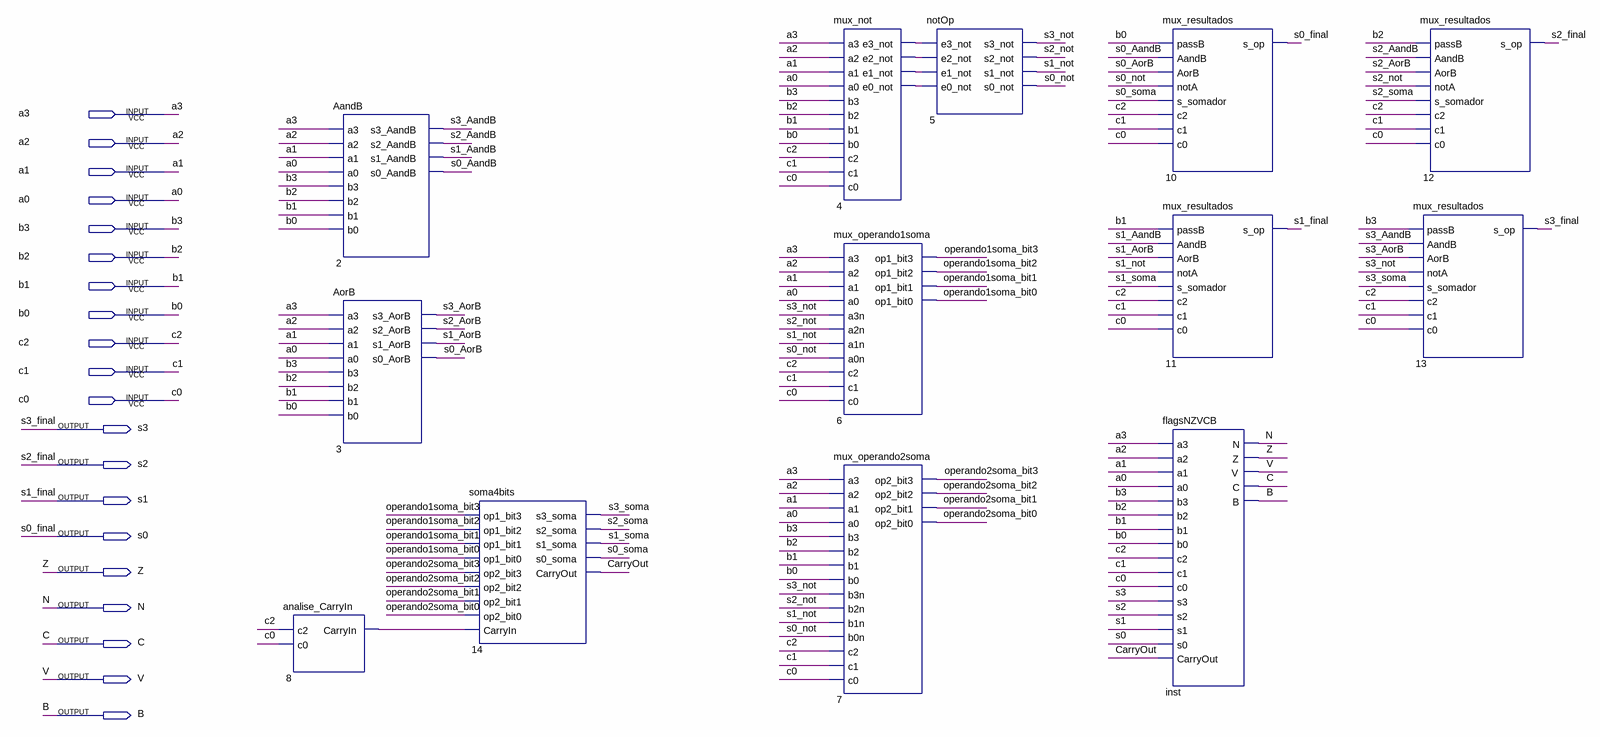
[diagram p0: schematic sheet]
// Quartus schematic ULA_main.bdf as structural Verilog: 13 symbols, 20 pins
module ULA_main (
  input  a3,
  input  a2,
  input  a1,
  input  a0,
  input  b3,
  input  b2,
  input  b1,
  input  b0,
  input  c2,
  input  c1,
  input  c0,
  output s3,
  output s2,
  output s1,
  output s0,
  output Z,
  output N,
  output C,
  output V,
  output B
);

  wire CarryOut, n4_e0_not, n4_e1_not, n4_e2_not, n4_e3_not, n8_carryin, operando1soma_bit0,
       operando1soma_bit1, operando1soma_bit2, operando1soma_bit3, operando2soma_bit0, operando2soma_bit1,
       operando2soma_bit2, operando2soma_bit3, s0_AandB, s0_AorB, s0_not, s0_soma, s1_AandB, s1_AorB, s1_not,
       s1_soma, s2_AandB, s2_AorB, s2_not, s2_soma, s3_AandB, s3_AorB, s3_not, s3_soma;

  analise_CarryIn u_8 (.c2(c2), .c0(c0), .CarryIn(n8_carryin));
  AandB u_2 (
    .a3(a3), .a2(a2), .a1(a1), .a0(a0), .b3(b3), .b2(b2), .b1(b1), .b0(b0), .s3_AandB(s3_AandB),
    .s2_AandB(s2_AandB), .s1_AandB(s1_AandB), .s0_AandB(s0_AandB));
  AorB u_3 (
    .a3(a3), .a2(a2), .a1(a1), .a0(a0), .b3(b3), .b2(b2), .b1(b1), .b0(b0), .s3_AorB(s3_AorB),
    .s2_AorB(s2_AorB), .s1_AorB(s1_AorB), .s0_AorB(s0_AorB));
  soma4bits u_14 (
    .op1_bit3(operando1soma_bit3), .op1_bit2(operando1soma_bit2), .op1_bit1(operando1soma_bit1),
    .op1_bit0(operando1soma_bit0), .op2_bit3(operando2soma_bit3), .op2_bit2(operando2soma_bit2),
    .op2_bit1(operando2soma_bit1), .op2_bit0(operando2soma_bit0), .CarryIn(n8_carryin), .s3_soma(s3_soma),
    .s2_soma(s2_soma), .s1_soma(s1_soma), .s0_soma(s0_soma), .CarryOut(CarryOut));
  mux_not u_4 (
    .a3(a3), .a2(a2), .a1(a1), .a0(a0), .b3(b3), .b2(b2), .b1(b1), .b0(b0), .c2(c2), .c1(c1), .c0(c0),
    .e3_not(n4_e3_not), .e2_not(n4_e2_not), .e1_not(n4_e1_not), .e0_not(n4_e0_not));
  mux_operando1soma u_6 (
    .a3(a3), .a2(a2), .a1(a1), .a0(a0), .a3n(s3_not), .a2n(s2_not), .a1n(s1_not), .a0n(s0_not), .c2(c2),
    .c1(c1), .c0(c0), .op1_bit3(operando1soma_bit3), .op1_bit2(operando1soma_bit2),
    .op1_bit1(operando1soma_bit1), .op1_bit0(operando1soma_bit0));
  mux_operando2soma u_7 (
    .a3(a3), .a2(a2), .a1(a1), .a0(a0), .b3(b3), .b2(b2), .b1(b1), .b0(b0), .b3n(s3_not), .b2n(s2_not),
    .b1n(s1_not), .b0n(s0_not), .c2(c2), .c1(c1), .c0(c0), .op2_bit3(operando2soma_bit3),
    .op2_bit2(operando2soma_bit2), .op2_bit1(operando2soma_bit1), .op2_bit0(operando2soma_bit0));
  notOp u_5 (
    .e3_not(n4_e3_not), .e2_not(n4_e2_not), .e1_not(n4_e1_not), .e0_not(n4_e0_not), .s3_not(s3_not),
    .s2_not(s2_not), .s1_not(s1_not), .s0_not(s0_not));
  mux_resultados u_10 (
    .passB(b0), .AandB(s0_AandB), .AorB(s0_AorB), .notA(s0_not), .s_somador(s0_soma), .c2(c2), .c1(c1),
    .c0(c0), .s_op(s0));
  mux_resultados u_11 (
    .passB(b1), .AandB(s1_AandB), .AorB(s1_AorB), .notA(s1_not), .s_somador(s1_soma), .c2(c2), .c1(c1),
    .c0(c0), .s_op(s1));
  flagsNZVCB inst (
    .a3(a3), .a2(a2), .a1(a1), .a0(a0), .b3(b3), .b2(b2), .b1(b1), .b0(b0), .c2(c2), .c1(c1), .c0(c0),
    .s3(s3), .s2(s2), .s1(s1), .s0(s0), .CarryOut(CarryOut), .N(N), .Z(Z), .V(V), .C(C), .B(B));
  mux_resultados u_12 (
    .passB(b2), .AandB(s2_AandB), .AorB(s2_AorB), .notA(s2_not), .s_somador(s2_soma), .c2(c2), .c1(c1),
    .c0(c0), .s_op(s2));
  mux_resultados u_13 (
    .passB(b3), .AandB(s3_AandB), .AorB(s3_AorB), .notA(s3_not), .s_somador(s3_soma), .c2(c2), .c1(c1),
    .c0(c0), .s_op(s3));

  // Other names for the same wires on the sheet: s0_final = s0; s1_final = s1; s2_final = s2; s3_final = s3
endmodule
